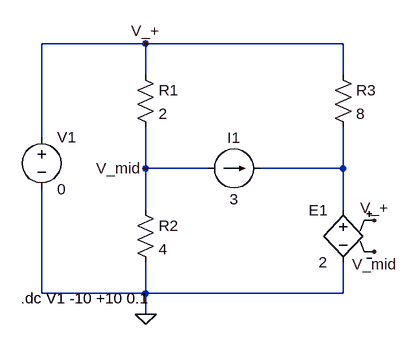
[diagram p0: schematic 3.52.asc]
3.52.asc, the LTspice schematic file:
Version 4
SHEET 1 1020 680
WIRE 576 -16 416 -16
WIRE 880 -16 576 -16
WIRE 576 32 576 -16
WIRE 880 32 880 -16
WIRE 416 128 416 -16
WIRE 576 176 576 112
WIRE 672 176 576 176
WIRE 880 176 880 112
WIRE 880 176 752 176
WIRE 576 240 576 176
WIRE 880 240 880 176
WIRE 416 368 416 208
WIRE 576 368 576 320
WIRE 576 368 416 368
WIRE 880 368 880 320
WIRE 880 368 576 368
WIRE 576 400 576 368
FLAG 576 400 0
FLAG 576 -16 V_+
FLAG 928 256 V_+
FLAG 576 176 V_mid
FLAG 928 304 V_mid
SYMBOL voltage 416 112 R0
WINDOW 123 0 0 Left 0
WINDOW 39 0 0 Left 0
SYMATTR InstName V1
SYMATTR Value 0
SYMBOL res 560 16 R0
SYMATTR InstName R1
SYMATTR Value 2
SYMBOL res 560 224 R0
SYMATTR InstName R2
SYMATTR Value 4
SYMBOL current 672 176 R270
WINDOW 0 32 40 VTop 2
WINDOW 3 -32 40 VBottom 2
WINDOW 123 0 0 Left 0
WINDOW 39 0 0 Left 0
SYMATTR InstName I1
SYMATTR Value 3
SYMBOL res 864 16 R0
SYMATTR InstName R3
SYMATTR Value 8
SYMBOL e 880 224 M0
SYMATTR InstName E1
SYMATTR Value 2
TEXT 384 376 Left 2 !.dc V1 -10 +10 0.1

The netlist it stands for:
* 3.52.asc
V1 V_+ 0 0
R1 V_+ V_mid 2
R2 V_mid 0 4
I1 V_mid N001 3
R3 V_+ N001 8
E1 N001 0 V_+ V_mid 2
.dc V1 -10 +10 0.1
.backanno
.end